# Altium schematic sheet Mesure.SchDoc
size A4; SheetNumber: 5; SheetTotal: 7
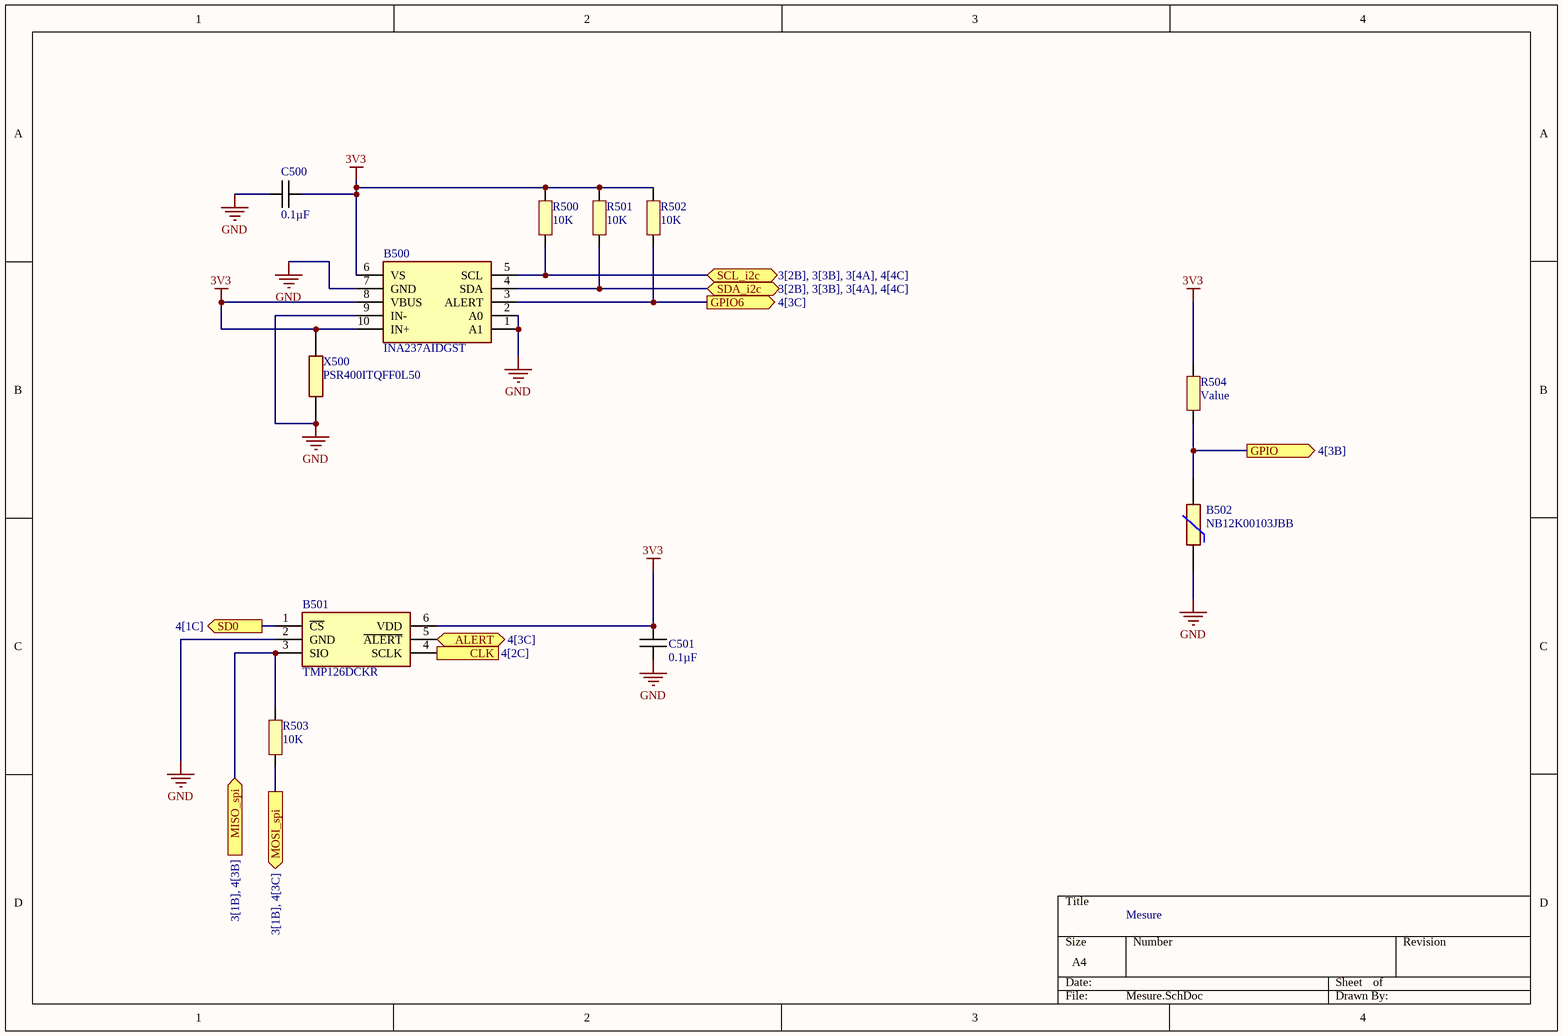
[diagram p0: Mesure.SchDoc]

## Parts
B500  INA237AIDGST  [SOP50P490X110-10N]
B501  TMP126DCKR  [SOT65P210X110-6N]
B502  NB12K00103JBB  [RESC2212X50N]
C500  0.1µF  [CAPC1005X06N]
C501  0.1µF  [CAPC1005X06N]
R500  10K  [RESC1005X06N]
R501  10K  [RESC1005X06N]
R502  10K  [RESC1005X06N]
R503  10K  [RESC1005X06N]
R504  Value  [RESC1005X06N]
X500  PSR400ITQFF0L50  [RESC10052X200N]

## Ports
ALERT (bidir, see 4[3C]), CLK (in, see 4[2C]), GPIO6 (out, see 4[3C]), GPIO (out, see 4[3B]), MISO_spi (in, see 3[1B], 4[3B]), MOSI_spi (out, see 3[1B], 4[3C]), SCL_i2c (bidir, see 3[2B], 3[3B], 3[4A], 4[4C]), SD0 (out, see 4[1C]), SDA_i2c (bidir, see 3[2B], 3[3B], 3[4A], 4[4C])

## Nets
3V3: B500.6(VS) B500.8(VBUS) B500.10(IN+) B501.6(VDD) C500.2 C501.2 R500.2 R501.2 R502.2 R504.1 X500.2
GND: B500.1(A1) B500.2(A0) B500.7(GND) B500.9(IN-) B501.2(GND) B502.1 C500.1 C501.1 X500.1
ALERT: B501.5(~{ALERT}) ; port ALERT
CLK: B501.4(SCLK) ; port CLK
GPIO: B502.2 R504.2 ; port GPIO
GPIO6: B500.3(ALERT) R502.1 ; port GPIO6
MISO_spi: B501.3(SIO) R503.1 ; port MISO_spi
MOSI_spi: R503.2 ; port MOSI_spi
SCL_i2c: B500.5(SCL) R500.1 ; port SCL_i2c
SD0: B501.1(~{CS}) ; port SD0
SDA_i2c: B500.4(SDA) R501.1 ; port SDA_i2c

## Notes on the sheet
- Mesure

## Library data of the parts
B500 = INA237AIDGST: Current Sense Amplifiers 85-V, 16-bit, I2C output current/voltage/power monitor with alert 10-VSSOP -40 to 125; Manufacturer_Name: Texas Instruments; Manufacturer_Part_Number: INA237AIDGST; Mouser Part Number: 595-INA237AIDGST
B501 = TMP126DCKR: Board Mount Temperature Sensors +/-0.25 C SPI temperature sensor with 175 C operation, CRC and slew-rate alert; Manufacturer_Name: Texas Instruments; Manufacturer_Part_Number: TMP126DCKR; Mouser Part Number: 595-TMP126DCKR
B502 = NB12K00103JBB: NTC SMD Thermistor, NB12K, 10K, 5% AVX 10k 0805 Protection NTC Thermistor, 5s, 2 x 1.25 x 1.3mm; Manufacturer_Name: Kyocera AVX; Geometry.Height: 0.5mm; Manufacturer_Part_Number: NB12K00103JBB; Mouser Part Number: 581-NB12K00103JBB; Mouser Price/Stock: https://www.mouser.co.uk/ProductDetail/AVX/NB12K00103JBB/?qs=4%252B6%252BTdINQeDPvI%252BQUQjJ3Q%3D%3D; Arrow Part Number: NB12K00103JBB; Arrow Price/Stock: https://www.arrow.com/en/products/nb12k00103jbb/avx; Datasheet Link: https://datasheet.datasheetarchive.com/originals/distributors/Datasheets-DGA6/551314.pdf
C500 C501 = Capacitor
R500-R504 = Resistor
X500 = PSR400ITQFF0L50: ROHM - PSR400ITQFF0L50 - SMD Current Sense Resistor, 500 ohm, PSR Series, 3921 [1052 Metric], 4 W, +/- 1%, Metal Strip; Manufacturer_Name: ROHM Semiconductor; Geometry.Height: 2mm; Manufacturer_Part_Number: PSR400ITQFF0L50; Mouser Part Number: 755-PSR400ITQFF0L50; Mouser Price/Stock: https://www.mouser.co.uk/ProductDetail/ROHM-Semiconductor/PSR400ITQFF0L50?qs=493kPxzlxfLaT1w5Mo%252BtHg%3D%3D; Arrow Part Number: *; Arrow Price/Stock: *; Datasheet Link: https://componentsearchengine.com/Datasheets/2/PSR400ITQFF0L50.pdf